# Altium schematic sheet MPPT_2.SchDoc
size A4; SheetNumber: 6; SheetTotal: 10
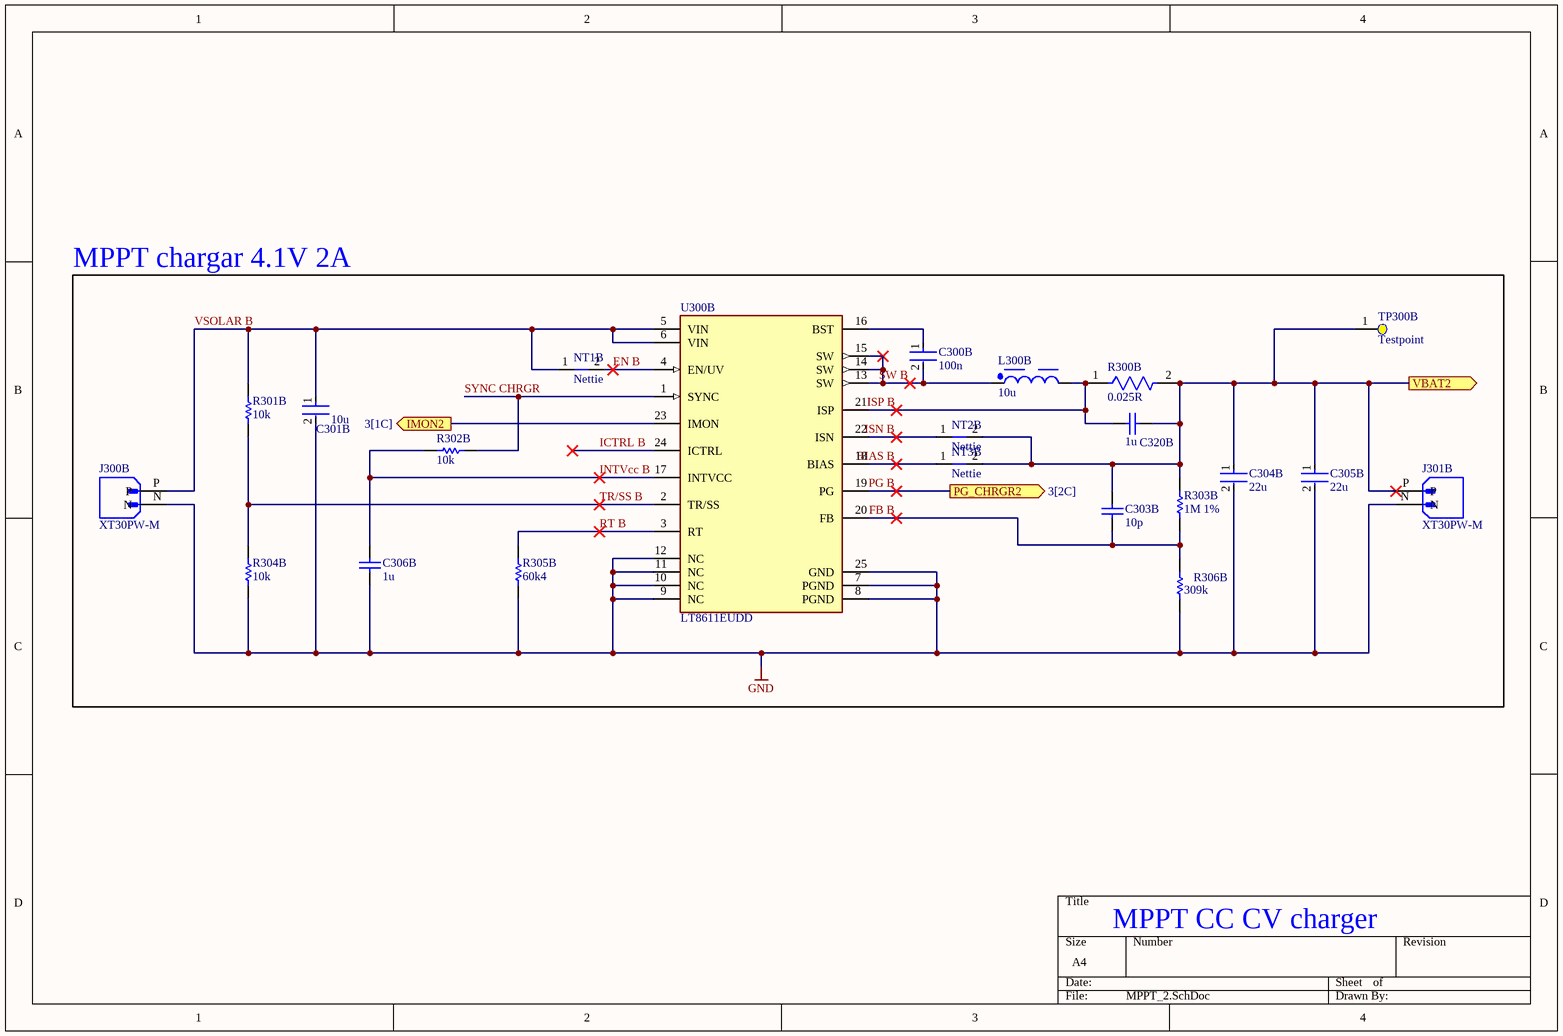
[diagram p0: MPPT_2.SchDoc]

## Parts
C300B  100n  [FP-0402B104K500CT-IPC_C]
C301B  10u  [FP-GRM31C-0_2-e0_3_0_8-MFG]
C303B  10p  [CAPC1608X90X35LL10T15]
C304B  22u  [FP-GRM21B-0_15-IPC_B]
C305B  22u  [FP-GRM21B-0_15-IPC_B]
C306B  1u  [CAPC2013X140X50NL20T25]
C320B  1u  [CAPC3216X110X50LL20T25]
J300B  XT30PW-M  [AMASS_XT30PW-M]
J301B  XT30PW-M  [AMASS_XT30PW-M]
L300B  10u  [WE-PD_7345]
NT1B  Nettie  [NET_TIE]
NT2B  Nettie  [NET_TIE]
NT3B  Nettie  [NET_TIE]
R300B  0.025R  [FP-WSL2512-0_762-MFG]
R301B  10k  [RESC1609X50X30NL8T20]
R302B  10k  [RESC1609X50X30NL8T20]
R303B  1M 1%  [RESC1005X40X25NL05T10]
R304B  10k  [RESC1609X50X30NL8T20]
R305B  60k4  [RESC2013X50X30NL20T20]
R306B  309k  [RESC3216X70X50LL05T20]
TP300B  Testpoint  [Testpoint]
U300B  LT8611EUDD  [FP-UDD-24-05-08-1833-IPC_B]

## Blocks framed on the sheet
MPPT chargar 4.1V 2A: C300B C301B C303B C304B C305B C306B C320B J300B J301B L300B NT1B NT2B NT3B R300B R301B R302B R303B R304B R305B R306B TP300B U300B

## Ports
IMON2 (out, see 3[1C]), PG_CHRGR2 (out, see 3[2C]), VBAT2 (out, see 2[2B], 3[3A])

## Nets
GND: C301B.2 C304B.2 C305B.2 C306B.1 J300B.N J301B.N R304B.2 R305B.1 R306B.1 U300B.7(PGND) U300B.8(PGND) U300B.9(NC) U300B.10(NC) U300B.11(NC) U300B.12(NC) U300B.25(GND)
BIAS B: NT3B.1 U300B.18(BIAS)
EN B: NT1B.2 U300B.4(EN/UV)
FB B: C303B.2 R303B.1 R306B.2 U300B.20(FB)
ICTRL B: U300B.24(ICTRL)
IMON2: U300B.23(IMON) ; port IMON2
INTVcc B: C306B.2 R302B.2 U300B.17(INTVCC)
ISN B: NT2B.1 U300B.22(ISN)
ISP B: C320B.1 L300B.2 R300B.1 U300B.21(ISP)
PG B: U300B.19(PG) ; port PG_CHRGR2
RT B: R305B.2 U300B.3(RT)
SW B: C300B.2 L300B.1 U300B.13(SW) U300B.14(SW) U300B.15(SW)
SYNC CHRGR: R302B.1 U300B.1(SYNC)
TR/SS B: R301B.2 R304B.1 U300B.2(TR/SS)
VBAT2: C303B.1 C304B.1 C305B.1 C320B.2 J301B.P NT2B.2 NT3B.2 R300B.2 R303B.2 TP300B.1 ; port VBAT2
VSOLAR B: C301B.1 J300B.P NT1B.1 R301B.1 U300B.5(VIN) U300B.6(VIN)
NetC300B_1: C300B.1 U300B.16(BST)

## Notes on the sheet
- MPPT CC CV charger

## Library data of the parts
C300B = CMP-45632-000010-1: CAP CER 0.1UF 50V X7R 0402; Tolerance: 10%; Capacitance: 100nF; Max Operating Temperature: 125°C; Case Code (Metric): 1005; RoHS Compliant: Yes; Series: -; Case Code (Imperial): 0402; Voltage Rating: 50V; Min Operating Temperature: -55°C; Mount: Surface Mount; Case/Package: 0402; Packaging: Cut Tape
C301B = CMP-06035-003589-1: Chip Multilayer Ceramic Capacitors for General Purpose, 1206, 10uF, X7R, 15%, 10%, 25V; Case Code (Imperial): 1206; Voltage Rating (DC): 25V; Voltage Rating: 25V; Length: 3.2mm; Lead Free: Lead Free; Thickness: 0.071inch; Package Quantity: 1; Width: 1.6mm; Max Operating Temperature: 125°C; Number of Pins: 2; Height: 1.6mm; Case Code (Metric): 3216; REACH SVHC: No SVHC; Radiation Hardening: No; Case/Package: 1206; Material: Ceramic; Tolerance: 10%; Voltage: 25V; Mount: Surface Mount; Packaging: Tape and Reel; Dielectric: X7R; Termination: SMD/SMT; Min Operating Temperature: -55°C; Capacitance: 10uF; Depth: 1.6mm
C303B = CMP-2006-02592-1: Part Number: GRM1885C1H100JA01D; Manufacturer: Murata
C304B C305B = CMP-2007-03385-2: Chip Multilayer Ceramic Capacitors for General Purpose, 0805, 22uF, X5R, 15%, 20%, 6.3V; Material: Ceramic; Max Operating Temperature: 85°C; Voltage: 6.3V; Min Operating Temperature: -55°C; Case/Package: 0805; Thickness: 0.053inch; Dielectric: X5R; Packaging: Tape and Reel; Depth: 1.25mm; Termination: SMD/SMT; Voltage Rating (DC): 6.3V; Radiation Hardening: No; Tolerance: 20%; Mount: Surface Mount; Lead Free: Lead Free; Package Quantity: 1; REACH SVHC: No SVHC; Voltage Rating: 6.3V; Capacitance: 22uF; Length: 2mm; Case Code (Imperial): 0805; Case Code (Metric): 2012; Width: 0.049inch; Height: 1.25mm
C306B = CMP-2007-03234-1: Part Number: C0805C105K3RACTU; Manufacturer: Kemet
C320B = CMP-2000-06011-1: Chip Capacitor, 1 uF, +/- 10%, 50 V, -55 to 125 degC, 1206 (3216 Metric), RoHS, Tape and Reel; Manufacturer: Kemet; Case Height: 1mm; Dielectric: X7R; Voltage Rating: 50V; Capacitance: 1uF; Temperature Coefficient / Code: +/-15%; Case Length: 3.2mm; Case Width: 1.6mm; Type: SMDMLCCX7R6.3-250VDCCommericalGrade; Class: Class1; Capacitance - nF: 1000nF; Datasheet URL: http://www.kemet.com/docfinder?Partnumber=C1206C105K5RACTU; Product Category: MultilayerCeramicCapacitorsMLCC-SMD/SMT; Termination Style: SMD/SMT; Dimensions: 1.6mmWx3.2mmLx1mmH; Voltage Rating DC: 50V; Datasheet Version: 02/2016; Packaging: Reel; Brand: Kemet; RoHS: Details; Minimum Operating Temperature: -55C; Operating Temperature Range: -55Cto+125C; Package Reference: 1206; Manufacturer URL: http://www.kemet.com/; Product: GeneralTypeMLCCs; Tolerance: 10%; Package Description: 2-Pin Surface Mount Device, Body 3.2 x 1.6 mm; Mounting Technology: SurfaceMount; Case Code - mm: 3216; Maximum Operating Temperature: +125C; Series: C1206C; Factory Pack Quantity: 2500; Package / Case: 1206(3216metric); Case Code - in: 1206
J300B J301B = XT30PW-M: Socket; DC supply; XT30; male; PIN: 2; on PCBs; THT; Colour: yellow; MF: AMASS; SnapEDA_Link: https://www.snapeda.com/parts/XT30PW-M/AMASS/view-part/?ref=snap; Package: None; Value: *; MP: XT30PW-M; Check_prices: https://www.snapeda.com/parts/XT30PW-M/AMASS/view-part/?ref=eda
L300B = CMP-0227-00113-2: 74477710, CUỘN CẢM LÕI FERALIT; NexarPartId: 11853718; Saturation Current: 2.6A; Current Rating: 2A; DC Resistance (DCR): 45mΩ; Inductance Tolerance: 20%; Core Material: Ferrite; Shielding: Shielded; Test Frequency: 1kHz; Inductance: 10µH; Self Resonant Frequency: 23MHz; RoHS: Compliant; Ambient Temperature Range Low: -40°C; Case/Package: Nonstandard; Composition: Wirewound; Height - Seated (Max): 4.4958mm; Mount: Surface Mount; Max DC Current: 2A; Length: 7.3mm; Termination: SMD/SMT; Depth: 7.3mm; Lead Pitch: 4mm; Ambient Temperature Range High: 85°C; Max Operating Temperature: 125°C; Width: 7.3mm; Lead Free: Lead Free; Min Operating Temperature: -40°C; Tolerance: 20%; Packaging: Cut Tape (CT); Number of Pins: 2; Height: 4.5mm
R300B = CMP-02407-013157-1: RES 0.025 OHM 1% 1W 2512; Resistance: 25mR; Voltage Rating: 150mV; Temperature Coefficient: 75ppm/°C; Features: Moisture Resistant; Number of Pins: 2; RoHS Compliant: No; Packaging: Tape and Reel; Power Rating: 1W; Height: 0.635mm; Tolerance: 1%; Case Code (Imperial): 2512; Number of Terminations: 2; Resistor Type: Metal Strip; Technology: METAL STRIP; Case Code (Metric): 6432; Max Operating Temperature: 170°C; Package Quantity: 2000; Termination: SMD/SMT; Reach SVHC Compliant: Yes; Width: 3.2mm; Military Standard: Not; Construction: Rectangular; Contact Plating: Tin; Radiation Hardening: No; Lead Free: Lead Free; Weight: 0.002243oz; Max Power Dissipation: 1W; Min Operating Temperature: -65°C; Resistance Tolerance: 1%; Case/Package: 2512; Depth: 3.18mm; Length: 6.4mm; Size Code: 2512; Series: WSL
R301B R302B R304B = CMP-1666-00005-4: Chip Resistor, 10 KOhm, +/- 1%, 100 mW, -55 to 155 degC, 0603 (1608 Metric), RoHS, Tape and Reel; Manufacturer: Vishay Semiconductor; Voltage Rating: 75 V; Max Operating Temperature: 155 degC; PackageDescription: 2-Pin Surface Mount Device, Body 1.575 x 0.85 mm; ComponentLink1Description: Manufacturer URL; RoHSCompliant: true; PackageReference: 0603; REACH SVHC: Unknown; Length: 1.55 mm; DatasheetVersion: 06/2012; Packaging: Tape and Reel; Min Operating Temperature: -55 degC; Mounting Technology: Surface Mount; ComponentLink2URL: https://datasheet.ciiva.com/11809/0900766b80d98afc-11809037.pdf; Height: 0.45 mm; ComponentLink2Description: Datasheet; Package Quantity: 5000; ComponentLink1URL: http://www.vishay.com/
R303B = CMP-2002-07490-1: Manufacturer: Yageo / Phycomp; Part Number: RC0402FR-071ML
R305B = CMP-2001-04043-1: Manufacturer: Vishay Dale; Part Number: CRCW080560K4FKEA
R306B = CMP-2003-00293-1: ERJ-8ENF3093V; Manufacturer: Panasonic; Part Number: ERJ-8ENF3093V
U300B = CMP-0491-02169-2: IC REG BUCK ADJ 2.5A 24QFN; Synchronous Rectifier: Yes; Number of Outputs: 1; Output Type: Adjustable; Switching Frequency: 2MHz; Efficiency: 96%; Output Voltage: 40V; Max Operating Temperature: 125°C; Output Current: 2.5A; RoHS Compliant: Yes; Case/Package: QFN; Package Quantity: 2500; Lead Free: Lead Free; Series: -; Number of Pins: 24; Min Operating Temperature: -40°C; Packaging: Tape and Reel